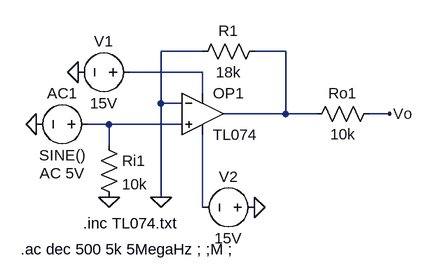
[diagram p0: schematic Draft1.asc]
Draft1.asc, the LTspice schematic file:
Version 4
SHEET 1 880 680
WIRE 192 16 128 16
WIRE 320 16 272 16
WIRE 192 48 80 48
WIRE 192 80 192 48
WIRE 128 96 128 16
WIRE 160 96 128 96
WIRE 320 112 320 16
WIRE 320 112 224 112
WIRE 368 112 320 112
WIRE 480 112 448 112
WIRE 48 128 16 128
WIRE 160 128 48 128
WIRE 48 160 48 128
WIRE 128 240 128 96
WIRE 192 256 192 144
FLAG 128 240 0
FLAG 48 240 0
FLAG 272 256 0
FLAG 0 48 0
FLAG -64 128 0
FLAG 480 112 Vo
SYMBOL res 288 0 R90
WINDOW 0 0 56 VBottom 2
WINDOW 3 32 56 VTop 2
SYMATTR InstName R1
SYMATTR Value 18k
SYMBOL res 32 144 R0
SYMATTR InstName Ri1
SYMATTR Value 10k
SYMBOL res 464 96 R90
WINDOW 0 0 56 VBottom 2
WINDOW 3 32 56 VTop 2
SYMATTR InstName Ro1
SYMATTR Value 10k
SYMBOL voltage 32 128 R90
WINDOW 0 -32 56 VBottom 2
WINDOW 3 32 56 VTop 2
WINDOW 123 60 56 VTop 2
WINDOW 39 0 0 Left 0
SYMATTR InstName AC1
SYMATTR Value SINE()
SYMATTR Value2 AC 5V
SYMBOL voltage 96 48 R90
WINDOW 0 -32 56 VBottom 2
WINDOW 3 32 56 VTop 2
SYMATTR InstName V1
SYMATTR Value 15V
SYMBOL voltage 288 256 R90
WINDOW 0 -32 56 VBottom 2
WINDOW 3 32 56 VTop 2
SYMATTR InstName V2
SYMATTR Value 15V
SYMBOL Opamps\\opamp2 192 48 R0
SYMATTR InstName OP1
SYMATTR Value TL074
TEXT 8 280 Left 2 !.inc TL074.txt
TEXT -88 320 Left 2 !.ac dec 500 5k 5MegaHz ; ;M ;

The netlist it stands for:
* Draft1.asc
R1 N001 0 18k
Ri1 N003 0 10k
Ro1 Vo N001 10k
V§AC1 N003 0 SINE() AC 5V
V1 N002 0 15V
V2 0 N004 15V
XOP1 N003 0 N002 N004 N001 TL074  ; pins In+ In- V+ V- OUT
.inc TL074.txt
.ac dec 500 5k 5MegaHz ; ;M ;
.backanno
.end